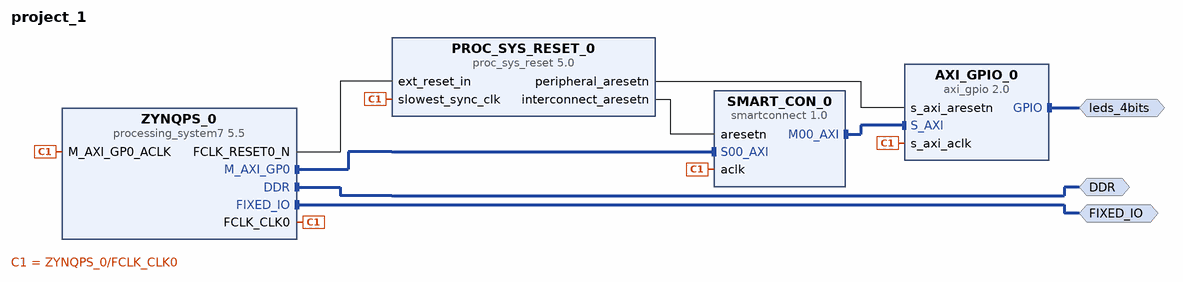
[diagram p0: block diagram of the top level]
# Vivado block design project_1, xc7z020clg484-1, Vivado 2024.2
create_bd_design project_1

create_bd_intf_port -mode Master -vlnv xilinx.com:interface:gpio_rtl:1.0 leds_4bits
create_bd_intf_port -mode Master -vlnv xilinx.com:interface:ddrx_rtl:1.0 DDR
create_bd_intf_port -mode Master -vlnv xilinx.com:display_processing_system7:fixedio_rtl:1.0 FIXED_IO

create_bd_cell -type ip -vlnv xilinx.com:ip:processing_system7:5.5 ZYNQPS_0
set_property -dict [list \
  CONFIG.PCW_APU_PERIPHERAL_FREQMHZ 666.666667 \
  CONFIG.PCW_ENET0_ENET0_IO {MIO 16 .. 27} \
  CONFIG.PCW_ENET0_GRP_MDIO_ENABLE 1 \
  CONFIG.PCW_ENET0_GRP_MDIO_IO {MIO 52 .. 53} \
  CONFIG.PCW_ENET0_PERIPHERAL_ENABLE 1 \
  CONFIG.PCW_ENET0_RESET_ENABLE 0 \
  CONFIG.PCW_ENET_RESET_ENABLE 1 \
  CONFIG.PCW_ENET_RESET_SELECT {Share reset pin} \
  CONFIG.PCW_FPGA0_PERIPHERAL_FREQMHZ 100.000000 \
  CONFIG.PCW_FPGA1_PERIPHERAL_FREQMHZ 150.000000 \
  CONFIG.PCW_FPGA2_PERIPHERAL_FREQMHZ 50.000000 \
  CONFIG.PCW_GPIO_MIO_GPIO_ENABLE 1 \
  CONFIG.PCW_GPIO_MIO_GPIO_IO MIO \
  CONFIG.PCW_I2C_RESET_ENABLE 1 \
  CONFIG.PCW_PERIPHERAL_BOARD_PRESET part0 \
  CONFIG.PCW_PRESET_BANK1_VOLTAGE {LVCMOS 1.8V} \
  CONFIG.PCW_QSPI_GRP_SINGLE_SS_ENABLE 1 \
  CONFIG.PCW_QSPI_GRP_SINGLE_SS_IO {MIO 1 .. 6} \
  CONFIG.PCW_QSPI_PERIPHERAL_ENABLE 1 \
  CONFIG.PCW_QSPI_PERIPHERAL_FREQMHZ 200.000000 \
  CONFIG.PCW_QSPI_QSPI_IO {MIO 1 .. 6} \
  CONFIG.PCW_SD0_GRP_CD_ENABLE 1 \
  CONFIG.PCW_SD0_GRP_CD_IO {MIO 47} \
  CONFIG.PCW_SD0_GRP_WP_ENABLE 1 \
  CONFIG.PCW_SD0_GRP_WP_IO {MIO 46} \
  CONFIG.PCW_SD0_PERIPHERAL_ENABLE 1 \
  CONFIG.PCW_SD0_SD0_IO {MIO 40 .. 45} \
  CONFIG.PCW_SDIO_PERIPHERAL_FREQMHZ 50 \
  CONFIG.PCW_SINGLE_QSPI_DATA_MODE x4 \
  CONFIG.PCW_TTC0_PERIPHERAL_ENABLE 1 \
  CONFIG.PCW_TTC0_TTC0_IO EMIO \
  CONFIG.PCW_UART1_PERIPHERAL_ENABLE 1 \
  CONFIG.PCW_UART1_UART1_IO {MIO 48 .. 49} \
  CONFIG.PCW_UART_PERIPHERAL_FREQMHZ 50 \
  CONFIG.PCW_UIPARAM_DDR_FREQ_MHZ 533.333313 \
  CONFIG.PCW_UIPARAM_DDR_PARTNO {MT41J128M16 HA-15E} \
  CONFIG.PCW_USB0_PERIPHERAL_ENABLE 1 \
  CONFIG.PCW_USB0_RESET_ENABLE 0 \
  CONFIG.PCW_USB0_USB0_IO {MIO 28 .. 39} \
  CONFIG.PCW_USB_RESET_ENABLE 1 \
  CONFIG.PCW_USB_RESET_SELECT {Share reset pin} \
  CONFIG.preset ZedBoard \
] [get_bd_cells ZYNQPS_0]
# 500 more settings of ZYNQPS_0 are not shown: defaults, MIO pin electricals, DDR timing, and values the tool derives
create_bd_cell -type ip -vlnv xilinx.com:ip:axi_gpio:2.0 AXI_GPIO_0
set_property -dict {CONFIG.C_ALL_OUTPUTS 1 CONFIG.C_GPIO_WIDTH 4} [get_bd_cells AXI_GPIO_0]
create_bd_cell -type ip -vlnv xilinx.com:ip:proc_sys_reset:5.0 PROC_SYS_RESET_0
create_bd_cell -type ip -vlnv xilinx.com:ip:smartconnect:1.0 SMART_CON_0
set_property -dict {CONFIG.NUM_CLKS 1 CONFIG.NUM_MI 1 CONFIG.NUM_SI 1} [get_bd_cells SMART_CON_0]

# ---- connections ----

connect_bd_intf_net -intf_net AXI_GPIO_0_GPIO_project_1_INTF_PORT_0_leds_4bits [get_bd_intf_ports leds_4bits] [get_bd_intf_pins AXI_GPIO_0/GPIO]
connect_bd_intf_net -intf_net SMART_CON_0_M00_AXI_AXI_GPIO_0_S_AXI [get_bd_intf_pins SMART_CON_0/M00_AXI] [get_bd_intf_pins AXI_GPIO_0/S_AXI]
connect_bd_intf_net [get_bd_intf_ports DDR] [get_bd_intf_pins ZYNQPS_0/DDR]
connect_bd_intf_net [get_bd_intf_ports FIXED_IO] [get_bd_intf_pins ZYNQPS_0/FIXED_IO]
connect_bd_intf_net -intf_net ZYNQPS_0_M_AXI_GP0_SMART_CON_0_S00_AXI [get_bd_intf_pins ZYNQPS_0/M_AXI_GP0] [get_bd_intf_pins SMART_CON_0/S00_AXI]
connect_bd_net -net PROC_SYS_RESET_0_interconnect_aresetn_SMART_CON_0_aresetn [get_bd_pins PROC_SYS_RESET_0/interconnect_aresetn] \
  [get_bd_pins SMART_CON_0/aresetn]
connect_bd_net -net PROC_SYS_RESET_0_peripheral_aresetn_AXI_GPIO_0_s_axi_aresetn [get_bd_pins PROC_SYS_RESET_0/peripheral_aresetn] \
  [get_bd_pins AXI_GPIO_0/s_axi_aresetn]
connect_bd_net -net ZYNQPS_0_FCLK_CLK0_ZYNQPS_0_M_AXI_GP0_ACLK [get_bd_pins ZYNQPS_0/FCLK_CLK0] \
  [get_bd_pins ZYNQPS_0/M_AXI_GP0_ACLK] [get_bd_pins AXI_GPIO_0/s_axi_aclk] [get_bd_pins PROC_SYS_RESET_0/slowest_sync_clk] \
  [get_bd_pins SMART_CON_0/aclk]
connect_bd_net -net ZYNQPS_0_FCLK_RESET0_N_PROC_SYS_RESET_0_ext_reset_in [get_bd_pins ZYNQPS_0/FCLK_RESET0_N] \
  [get_bd_pins PROC_SYS_RESET_0/ext_reset_in]

# ---- address map ----
assign_bd_address -offset 0x41200000 -range 64K -target_address_space [get_bd_addr_spaces ZYNQPS_0/Data] [get_bd_addr_segs AXI_GPIO_0/S_AXI/Reg]

validate_bd_design
save_bd_design
